# EAGLE design DC25_HHV_RE-P1 (EAGLE 6.6.0)
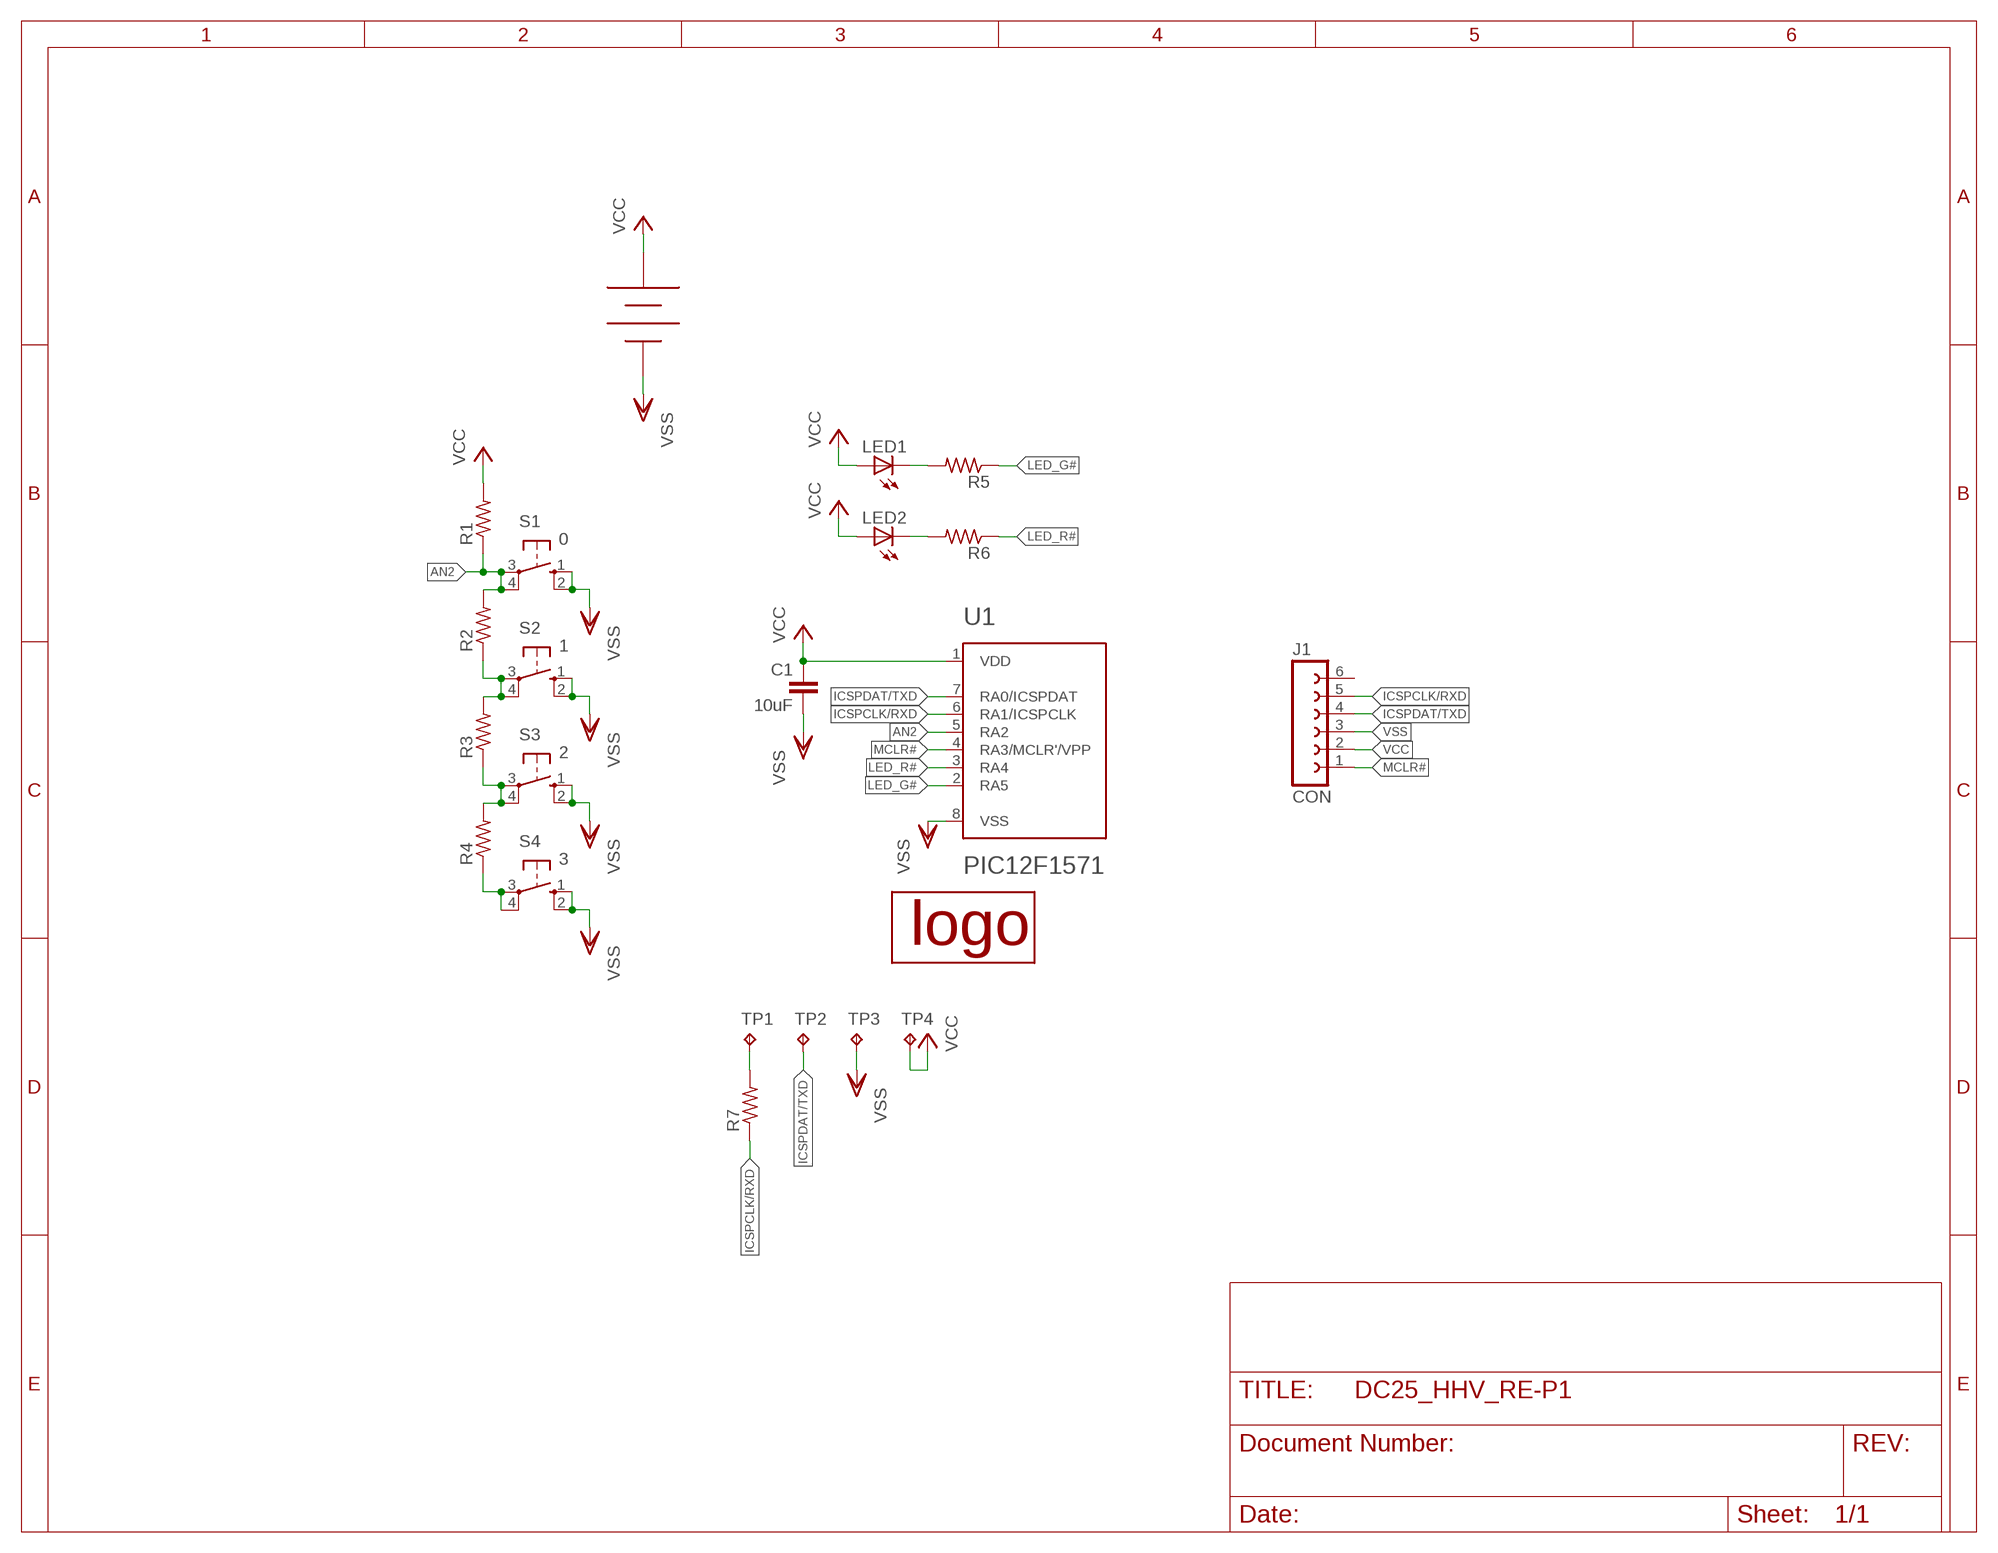
[diagram p0: schematic, sheet 1]
FRAME1 (FRAME_A_L): REV: P1

## Parts
BT1  BAT-HLD-001-THM  [BAT-HLD-001-THM]
C1  10uF  C-EU050-024X044  [C050-024X044]
J1  CON  FE06-1  [FE06]
LED1  LED5MM  [LED5MM]
LED2  LED5MM  [LED5MM]
R1  R-US_0207/10  [0207/10]
R2  R-US_0207/10  [0207/10]
R3  R-US_0207/10  [0207/10]
R4  R-US_0207/10  [0207/10]
R5  R-US_0207/10  [0207/10]
R6  R-US_0207/10  [0207/10]
R7  R-US_R0402  [R0402]
S1  0  10-XX  [B3F-10XX]
S2  1  10-XX  [B3F-10XX]
S3  2  10-XX  [B3F-10XX]
S4  3  10-XX  [B3F-10XX]
TP1  TPTP13R  [TP13R]
TP2  TPTP13R  [TP13R]
TP3  TPTP13R  [TP13R]
TP4  TPTP13R  [TP13R]
U1  PIC12F1571  [DIL8]
U$1  KBELOGO  [KBELOGO]

## Nets
AN2: R1.1 R2.2 S1.3(P) S1.4(P1) U1.5(RA2)
ICSPCLK/RXD: J1.5 R7.1 U1.6(RA1/ICSPCLK)
ICSPDAT/TXD: J1.4 TP2.TP U1.7(RA0/ICSPDAT)
LED_G#: R5.1 U1.2(RA5)
LED_R#: R6.1 U1.3(RA4)
MCLR#: J1.1 U1.4(RA3/MCLR'/VPP)
N$1: R4.1 S4.3(P) S4.4(P1)
N$2: R3.1 R4.2 S3.3(P) S3.4(P1)
N$3: LED2.K(C) R6.2
N$4: R7.2 TP1.TP
N$5: R2.1 R3.2 S2.3(P) S2.4(P1)
N$8: LED1.K(C) R5.2
VCC: BT1.+@0(VCC) BT1.+@1(VCC) BT1.+@2(VCC) BT1.+@3(VCC) C1.1 J1.2 LED1.A LED2.A R1.2 TP4.TP U1.1(VDD)
VSS: BT1.-(VSS) C1.2 J1.3 S1.1(S) S1.2(S1) S2.1(S) S2.2(S1) S3.1(S) S3.2(S1) S4.1(S) S4.2(S1) TP3.TP U1.8(VSS)
Unconnected: J1.6

## Library data of the parts
BT1 = cuslibrary:BAT-HLD-001-THM
C1 = rcl:C-EU: CAPACITOR, European symbol
J1 = con-lsta:FE06-1: FEMALE HEADER; OC_FARNELL: unknown; OC_NEWARK: unknown
LED1 LED2 = led:LED: LED OSRAM: - CHIPLED LG R971, LG N971, LY N971, LG Q971, LY Q971, LO R971, LY R971 LH N974, LH R974 LS Q976, LO Q976, LY Q976 LO Q996 - Hyper CHIPLED LW Q18S LB Q993, LB Q99A, LB R99A - SideLED LS A670, LO A670, LY A670, LG A670, LP A670 LB A673, LV A673, LT A673, LW A673 LH A674 LY A675 LS A676, LA A676, LO A676, LY A676, LW A676 LS A679, LY A679, LG A679 - Hyper Micro SIDELED® LS Y876, LA Y876, LO Y876, LY Y876 LT Y87S - SmartLED LW L88C, LW L88S LB L89C, LB L89S, LG L890 LS L89K, LO L89K, LY L89K LS L896, LA L896, LO L896, LY L896 - TOPLED LS T670, LO T670, LY T670, LG T670, LP T670 LSG T670, LSP T670, LSY T670, LOP T670, LYG T670 LG T671, LOG T671, LSG T671 LB T673, LV T673, LT T673, LW T673 LH T674 LS T676, LA T676, LO T676, LY T676, LB T676, LH T676, LSB T676, LW T676 LB T67C, LV T67C, LT T67C, LS T67K, LO T67K, LY T67K, LW E67C LS E67B, LA E67B, LO E67B, LY E67B, LB E67C, LV E67C, LT E67C LW T67C LS T679, LY T679, LG T679 LS T770, LO T770, LY T770, LG T770, LP T770 LB T773, LV T773, LT T773, LW T773 LH T774 LS E675, LA E675, LY E675, LS T675 LS T776, LA T776, LO T776, LY T776, LB T776 LHGB T686 LT T68C, LB T68C - Hyper Mini TOPLED® LB M676 - Mini TOPLED Santana® LG M470 LS M47K, LO M47K, LY M47K Source: http://www.osram.convergy.de LUXEON: - LUMILED® LXK2-PW12-R00, LXK2-PW12-S00, LXK2-PW14-U00, LXK2-PW14-V00 LXK2-PM12-R00, LXK2-PM12-S00, LXK2-PM14-U00 LXK2-PE12-Q00, LXK2-PE12-R00, LXK2-PE12-S00, LXK2-PE14-T00, LXK2-PE14-U00 LXK2-PB12-K00, LXK2-PB12-L00, LXK2-PB12-M00, LXK2-PB14-N00, LXK2-PB14-P00, LXK2-PB14-Q00 LXK2-PR12-L00, LXK2-PR12-M00, LXK2-PR14-Q00, LXK2-PR14-R00 LXK2-PD12-Q00, LXK2-PD12-R00, LXK2-PD12-S00 LXK2-PH12-R00, LXK2-PH12-S00 LXK2-PL12-P00, LXK2-PL12-Q00, LXK2-PL12-R00 Source: www.luxeon.com KINGBRIGHT: KA-3528ASYC Source: www.kingbright.com
R1-R7 = rcl:R-US_: RESISTOR, American symbol
S1-S4 = switch-omron:10-XX: OMRON SWITCH; MPN: B3F-1000; OC_FARNELL: 176432; OC_NEWARK: 36M3542
TP1-TP4 = testpad:TP: Test pad
U1 = cuslibrary:PIC12F1571: PIC12F1571/2
U$1 = cuslibrary:KBELOGO

## Board
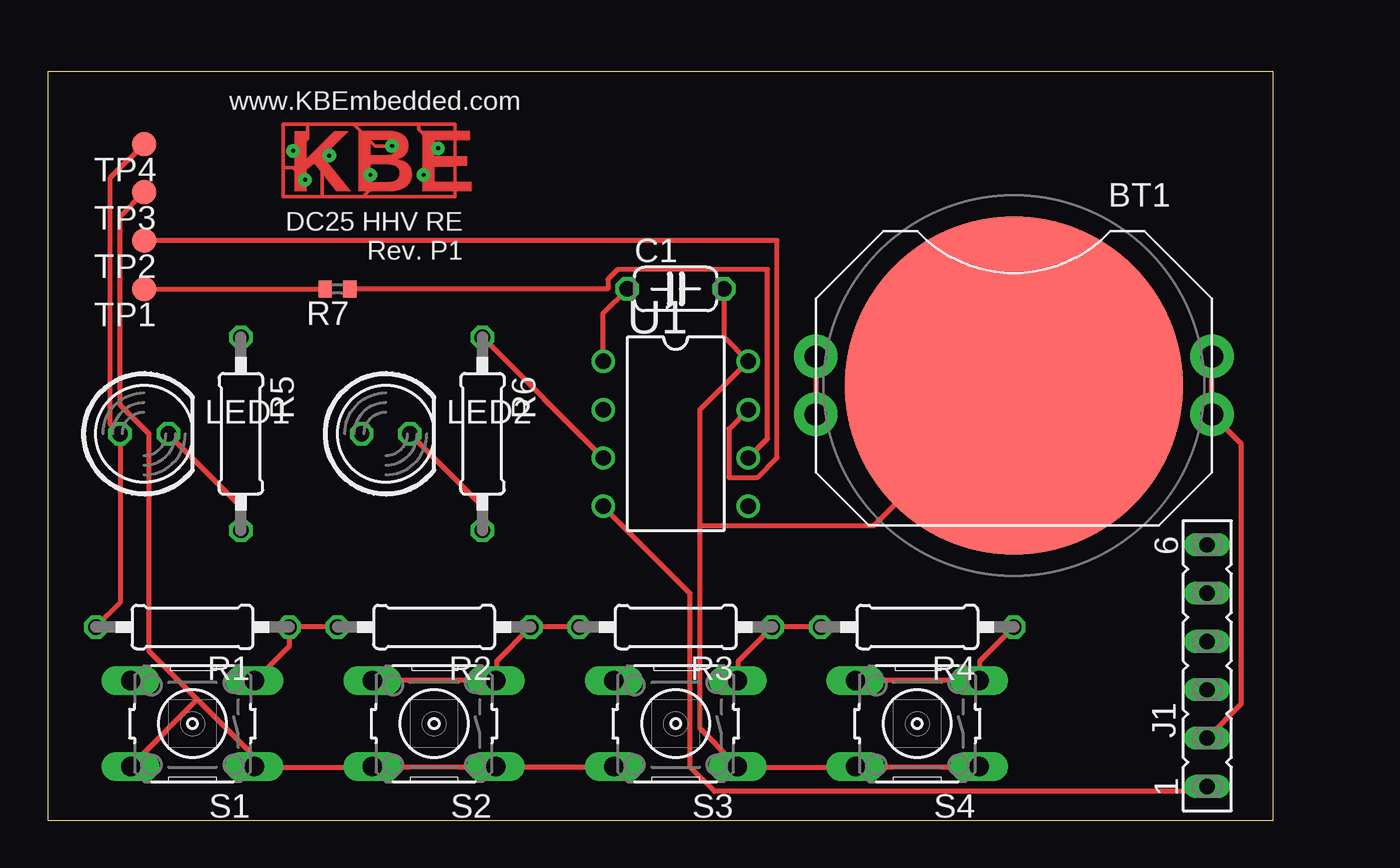
[diagram p1: board, top side]
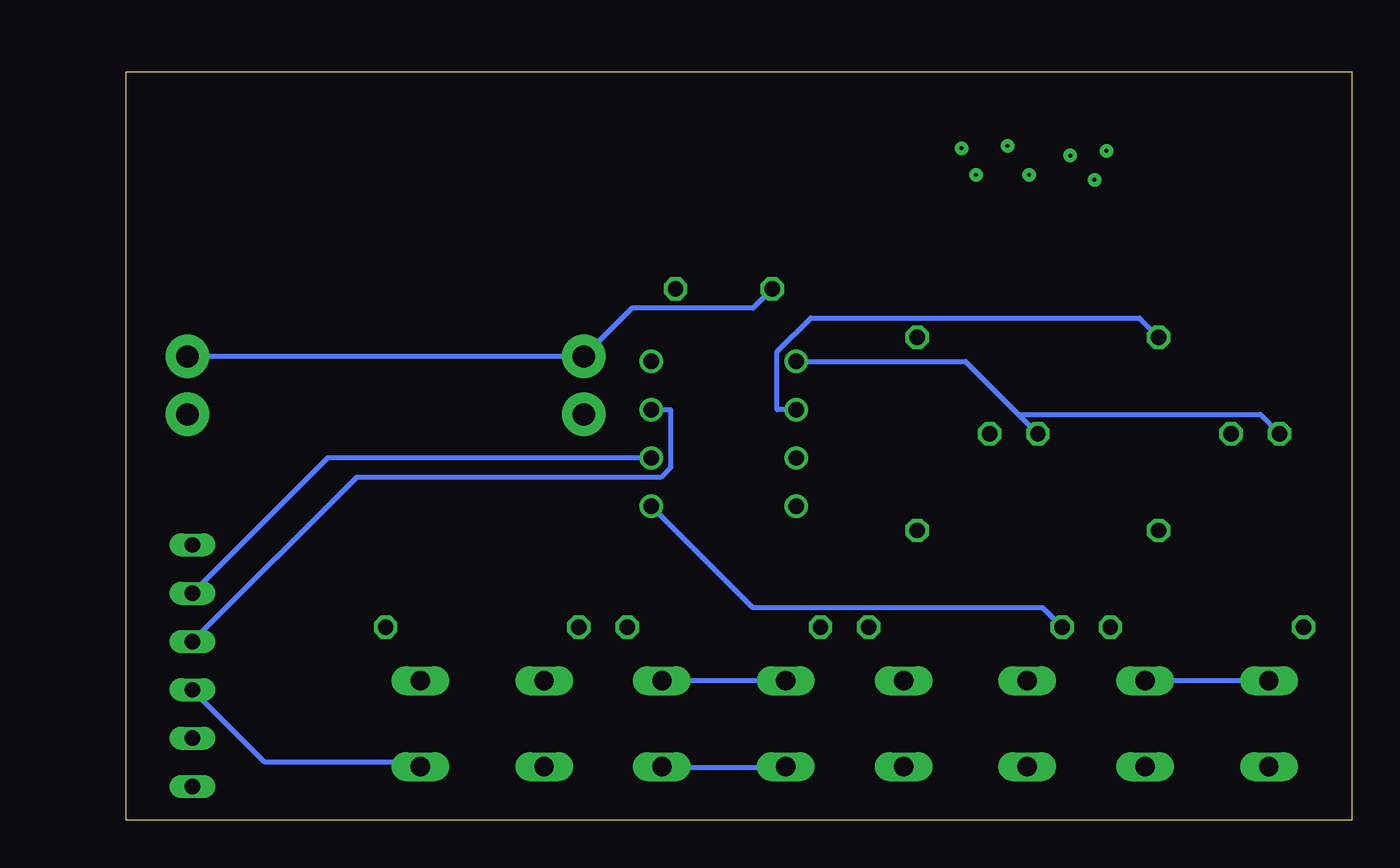
[diagram p2: board, bottom side, seen from below]

Size 64.44 x 39.36 mm. Coordinates in mm from the lower left corner, seen from the top.
Outline: 0,0 64.44,0 64.44,39.36 0,39.36 0,0
Copper layers (1*16): Top 0.0356mm / dielectric 1.5011mm / Bottom 0.0356mm
Design rules "OSHPark *": minimum track width 10mil, minimum drill 13mil, track to track 10mil, track to pad 10mil, pad to pad 10mil, via to via 10mil, smd to smd 10mil, copper to edge 15mil, drill to drill 6mil, minimum pad ring 7mil, minimum via ring 7mil, stop-mask expansion 3mil, vias tented up to drill 0mil, thermal gap 10mil

### Footprints (pad centres in the part's own frame; a part is rotated, then mirrored left to right if it is on the bottom)
BAT-HLD-001-THM = drill 1.168 pad 2.286: +@0 -10.414,1.524; +@1 -10.414,-1.524; +@2 10.414,1.524; +@3 10.414,-1.524 | smd 17.78 x 17.78: - 0,0
C050-024X044 = drill 0.813 octagon: 1 -2.54,0; 2 2.54,0
FE06 = drill 0.813 long: 1 -6.35,0; 2 -3.81,0; 3 -1.27,0; 4 1.27,0; 5 3.81,0; 6 6.35,0
LED5MM = drill 0.813 octagon: A -1.27,0; K 1.27,0
0207/10 = drill 0.813 octagon: 1 -5.08,0; 2 5.08,0
R0402 = smd 0.7 x 0.9: 1 -0.65,0; 2 0.65,0
B3F-10XX = drill 1.016 long: 1 -3.251,2.261; 2 3.251,2.261; 3 -3.251,-2.261; 4 3.251,-2.261
TP13R = smd 1.3 x 1.3: TP 0,0
DIL8 = drill 0.813: 1 -3.81,-3.81; 2 -1.27,-3.81; 3 1.27,-3.81; 4 3.81,-3.81; 5 3.81,3.81; 6 1.27,3.81; 7 -1.27,3.81; 8 -3.81,3.81
KBELOGO = drill 0.203 pad 0.711: P$1 -1.194,0.152; P$2 -2.464,-1.118; P$3 -3.099,0.406; P$4 0.965,-0.864; P$5 2.108,0.66; P$6 4.521,0.533; P$7 3.759,-0.864

### Placement (x,y rotation side)
BT1  50.8,22.86 180 top
C1  33.02,27.94 0 top
J1  60.96,8.13 90 top
LED1  5.08,20.32 0 top
LED2  17.78,20.32 0 top
R1  7.62,10.16 180 top
R2  20.32,10.16 180 top
R3  33.02,10.16 180 top
R4  45.72,10.16 180 top
R5  10.16,20.32 270 top
R6  22.86,20.32 270 top
R7  15.24,27.94 180 top
S1  7.62,5.08 180 top
S2  20.32,5.08 180 top
S3  33.02,5.08 180 top
S4  45.72,5.08 180 top
TP1  5.08,27.94 180 top
TP2  5.08,30.48 180 top
TP3  5.08,33.02 180 top
TP4  5.08,35.56 180 top
U1  33.02,20.32 270 top
U$1  16,34.8 0 top

### Tracks (layer width: path | path; a pad name or v marks a point on that pad's centre or on a via)
AN2
  Top 0.254: R2.2 R1.1 12.7,9.14 10.92,7.37 S1.3
  Bottom 0.254: S1.4 4.57,7.37 10.67,7.37 S1.3 | U1.5 31.5,11.18 16.26,11.18 R2.2
ICSPCLK/RXD
  Top 0.254: U1.6 37.85,20.07 37.85,28.96 29.97,28.96 29.46,28.45 29.46,27.94 16,27.94 R7.1
  Bottom 0.254: J1.5 53.85,19.05 U1.6
ICSPDAT/TXD
  Top 0.254: TP2.TP 38.35,30.48 38.35,19.05 37.34,18.03 35.81,18.03 35.81,20.57 U1.7
  Bottom 0.254: J1.4 52.32,18.03 36.32,18.03 35.81,18.54 35.81,21.59 U1.7
LED_G#
  Bottom 0.254: R5.1 11.18,26.42 28.45,26.42 30.23,24.64 30.23,21.59 U1.2
LED_R#
  Top 0.254: R6.1 U1.3
MCLR#
  Top 0.254: U1.4 33.78,11.94 33.78,2.79 35.05,1.52 60.96,1.52 J1.1
N$1
  Top 0.254: R4.1 49.02,8.38 49.02,7.37 S4.3 48.77,7.37 42.67,7.37 S4.4
N$2
  Top 0.254: R4.2 R3.1 36.32,8.38 36.32,7.37 S3.3
  Bottom 0.254: S3.4 29.97,7.37 36.07,7.37 S3.3
N$3
  Top 0.254: LED2.K 22.86,16.51 R6.2
N$4
  Top 0.254: TP1.TP 14.48,27.94 R7.2
N$5
  Top 0.254: R3.2 R2.1 23.62,8.38 23.62,7.37 S2.3 23.37,7.37 17.27,7.37 S2.4
N$8
  Top 0.254: LED1.K 10.16,16.51 R5.2
VCC
  Top 0.254: TP4.TP 3.3,33.78 3.3,20.83 LED1.A 3.81,11.43 R1.2 | J1.2 62.74,6.1 62.74,19.81 BT1.+@0 BT1.+@1 | BT1.+@3 BT1.+@2 | C1.1 29.21,26.67 U1.1
  Bottom 0.254: 17.53,21.34 20.32,24.13 U1.1 | 17.53,21.34 LED2.A | C1.1 31.5,26.92 37.85,26.92 BT1.+@3 BT1.+@1 | LED1.A 4.83,21.34 17.53,21.34
VSS
  Top 0.254: TP3.TP 3.81,31.75 3.81,21.84 5.33,20.32 5.33,8.89 7.87,6.35 | 7.87,6.35 10.67,3.56 10.67,3.05 S1.1 10.92,2.79 17.02,2.79 S2.2 17.27,2.79 23.37,2.79 S2.1 23.62,2.79 29.72,2.79 S3.2 | 7.87,6.35 4.57,3.05 S1.2 | S4.1 48.77,2.79 42.67,2.79 S4.2 42.42,2.79 36.32,2.79 S3.1 36.07,3.05 34.29,4.83 34.29,15.49 | C1.2 35.56,25.4 U1.8 34.29,21.59 34.29,15.49 | BT1.- 43.43,15.49 34.29,15.49
  Bottom 0.254: J1.3 57.15,3.05 49.02,3.05 S4.1 | S3.2 29.97,2.79 36.07,2.79 S3.1

### Text on the board
tNames: www.KBEmbedded.com | DC25 HHV RE / Rev. P1